# Altium project roneMotorBoard-v8-msp.PrjPcb
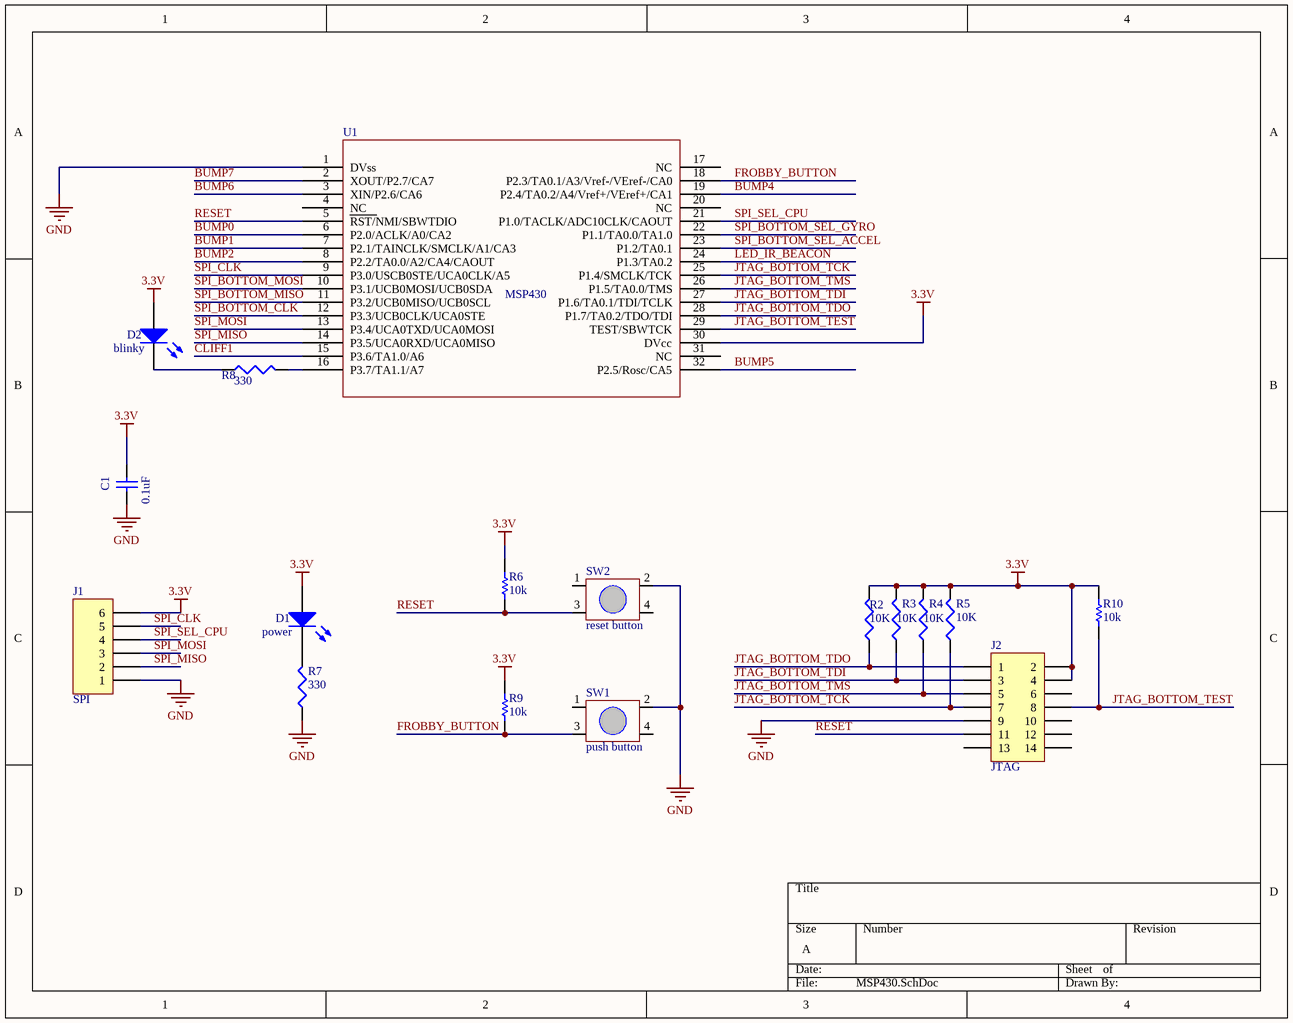
[diagram p0: MSP430.SchDoc]
5 sheets, 60 parts. Net scope: global (net labels, ports and power ports of the same name join across sheets).
Board file: roneMotorBoard-v8-msp.PcbDoc
Sheets:
  MSP430.SchDoc
  motorEncoder.SchDoc
  LineCliffSensors.SchDoc
  GyroAccelHeaders.SchDoc
  BumpSensors.SchDoc

## Sheet MSP430.SchDoc
size A

### Parts
C1  value 0.1uF  [CAPC1005L]  (hidden comment: Cap Semi)
D1  power  [INDC2012L]
D2  blinky  [INDC2012L]
J1  SPI  [HDR1X6]
J2  JTAG  [HDR2X7]
R2  value 10K  [RESC1608L]  (hidden comment: Res3)
R3  value 10K  [RESC1608L]  (hidden comment: Res3)
R4  value 10K  [RESC1608L]  (hidden comment: Res3)
R5  value 10K  [RESC1608L]  (hidden comment: Res3)
R6  value 10k  [RESC1608L]  (hidden comment: Res Semi)
R7  330  [RESC1608L]
R8  330  [RESC1608L]
R9  value 10k  [RESC1608L]  (hidden comment: Res Semi)
R10  value 10k  [RESC1608L]  (hidden comment: Res Semi)
SW1  push button  [SwitchTall-TL330]
SW2  reset button  [SwitchTall-TL330]
U1  MSP430  [MSP430_32PIN]

### Nets
3.3V: C1.2 D1.1(A) D2.1(A) J1.6 J2.2 J2.4 R2.2 R3.2 R4.2 R5.2 R6.2 R9.2 R10.2 U1.30(DVcc)
GND: C1.1 J1.1 J2.9 R7.1 SW1.2 SW2.2 U1.1(DVss)
BUMP0: U1.6(P2.0/ACLK/A0/CA2)
BUMP1: U1.7(P2.1/TAINCLK/SMCLK/A1/CA3)
BUMP2: U1.8(P2.2/TA0.0/A2/CA4/CAOUT)
BUMP4: U1.19(P2.4/TA0.2/A4/Vref+/VEref+/CA1)
BUMP5: U1.32(P2.5/Rosc/CA5)
BUMP6: U1.3(XIN/P2.6/CA6)
BUMP7: U1.2(XOUT/P2.7/CA7)
CLIFF1: U1.15(P3.6/TA1.0/A6)
FROBBY_BUTTON: R9.1 SW1.3 U1.18(P2.3/TA0.1/A3/Vref-/VEref-/CA0)
JTAG_BOTTOM_TCK: J2.7 R5.1 U1.25(P1.4/SMCLK/TCK)
JTAG_BOTTOM_TDI: J2.3 R3.1 U1.27(P1.6/TA0.1/TDI/TCLK)
JTAG_BOTTOM_TDO: J2.1 R2.1 U1.28(P1.7/TA0.2/TDO/TDI)
JTAG_BOTTOM_TEST: J2.8 R10.1 U1.29(TEST/SBWTCK)
JTAG_BOTTOM_TMS: J2.5 R4.1 U1.26(P1.5/TA0.0/TMS)
LED_IR_BEACON: U1.24(P1.3/TA0.2)
RESET: J2.11 R6.1 SW2.3 U1.5(RST/NMI/SBWTDIO)
SPI_BOTTOM_CLK: U1.12(P3.3/UCB0CLK/UCA0STE)
SPI_BOTTOM_MISO: U1.11(P3.2/UCB0MISO/UCB0SCL)
SPI_BOTTOM_MOSI: U1.10(P3.1/UCB0MOSI/UCB0SDA)
SPI_BOTTOM_SEL_ACCEL: U1.23(P1.2/TA0.1)
SPI_BOTTOM_SEL_GYRO: U1.22(P1.1/TA0.0/TA1.0)
SPI_CLK: J1.5 U1.9(P3.0/USCB0STE/UCA0CLK/A5)
SPI_MISO: J1.2 U1.14(P3.5/UCA0RXD/UCA0MISO)
SPI_MOSI: J1.3 U1.13(P3.4/UCA0TXD/UCA0MOSI)
SPI_SEL_CPU: J1.4 U1.21(P1.0/TACLK/ADC10CLK/CAOUT)
NetD1_2: D1.2(K) R7.2
NetD2_2: D2.2(K) R8.1
NetR8_2: R8.2 U1.16(P3.7/TA1.1/A7)

Not connected (* = marked no-connect by the designer): J2 6 10 12 13 14; SW1 1 4; SW2 1 4; U1 4(NC) 17(NC) 20(NC) 31(NC)

### Library data of the parts
C1 = Cap Semi: Capacitor (Semiconductor SIM Model); Published: 8-Jun-2000; LatestRevisionDate: 29-May-2009; LatestRevisionNote: IPC-7351 Footprint Added.; PackageReference: C1206; Publisher: Altium Limited; PackageDescription: Chip Capacitor
D1 D2 = LED
J1 = Header 6: Header, 6-Pin; LatestRevisionDate: 17-Jul-2002; LatestRevisionNote: Re-released for DXP Platform.; Publisher: Altium Limited
J2 = Header 7X2: Header, 7-Pin, Dual row; LatestRevisionDate: 17-Jul-2002; LatestRevisionNote: Re-released for DXP Platform.; Publisher: Altium Limited
R2-R5 = Res3: Resistor; Published: 8-Jun-2000; LatestRevisionDate: 29-May-2009; LatestRevisionNote: IPC-7351 Footprint Added.; PackageReference: J1-0603; Publisher: Altium Limited; PackageDescription: Chip Resistor
R6 R9 R10 = Res Semi: Semiconductor Resistor; Published: 8-Jun-2000; LatestRevisionDate: 17-Jul-2002; LatestRevisionNote: Re-released for DXP Platform.; PackageReference: AXIAL-0.5; Publisher: Altium Limited
R7 = Res3: Resistor; Value: res3; Published: 8-Jun-2000; LatestRevisionDate: 29-May-2009; LatestRevisionNote: IPC-7351 Footprint Added.; PackageReference: J1-0603; Publisher: Altium Limited; PackageDescription: Chip Resistor
R8 = Res3: Resistor; Value: RES3; Published: 8-Jun-2000; LatestRevisionDate: 29-May-2009; LatestRevisionNote: IPC-7351 Footprint Added.; PackageReference: J1-0603; Publisher: Altium Limited; PackageDescription: Chip Resistor
SW1 SW2 = Switch-TL330
U1 = MSP430_32pin

## Sheet motorEncoder.SchDoc
size A
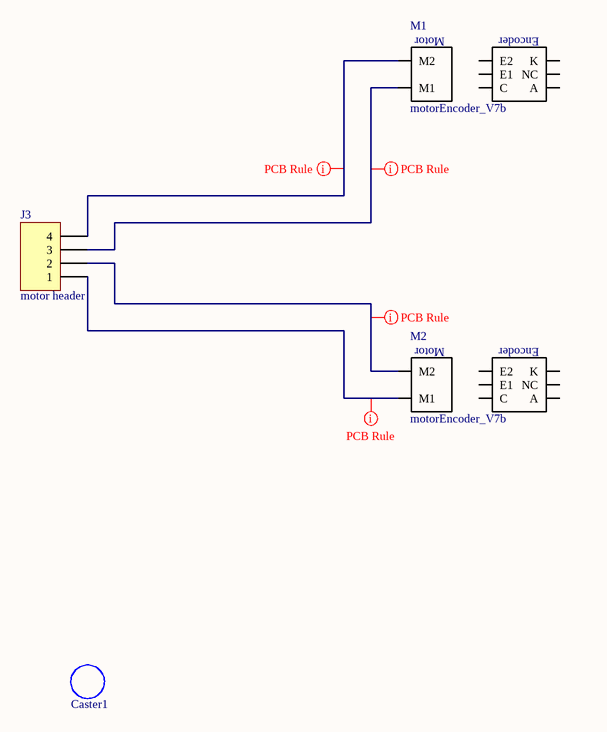
[diagram p1: motorEncoder.SchDoc]

### Parts
Caster1  non connect  [3/4"CASTER2]  (value not drawn)
J3  motor header  [HDR1X4]
M1  motorEncoder_V7b  [motorEncoder_V7b]
M2  motorEncoder_V7b  [motorEncoder_V7b]

### Nets
NetJ3_1: J3.1 M2.M1
NetJ3_2: J3.2 M2.M2
NetJ3_3: J3.3 M1.M1
NetJ3_4: J3.4 M1.M2

Not connected (* = marked no-connect by the designer): M1 A C E1 E2 K NC; M2 A C E1 E2 K NC

### Layout directives
rule Width Constraint [Pref Width = 20mil    Min Width = 10mil    Max Width = 25mil]: NetJ3_1, NetJ3_2, NetJ3_3, NetJ3_4

### Notes on the sheet
- (in symbol motorEncoder_V7b) Motor; Encoder

### Library data of the parts
Caster1 = Caster 3/4in: This is just a space saver to get the caster onto the pcb
J3 = Header 4: Header, 4-Pin; LatestRevisionDate: 17-Jul-2002; LatestRevisionNote: Re-released for DXP Platform.; Publisher: Altium Limited

## Sheet LineCliffSensors.SchDoc
size A
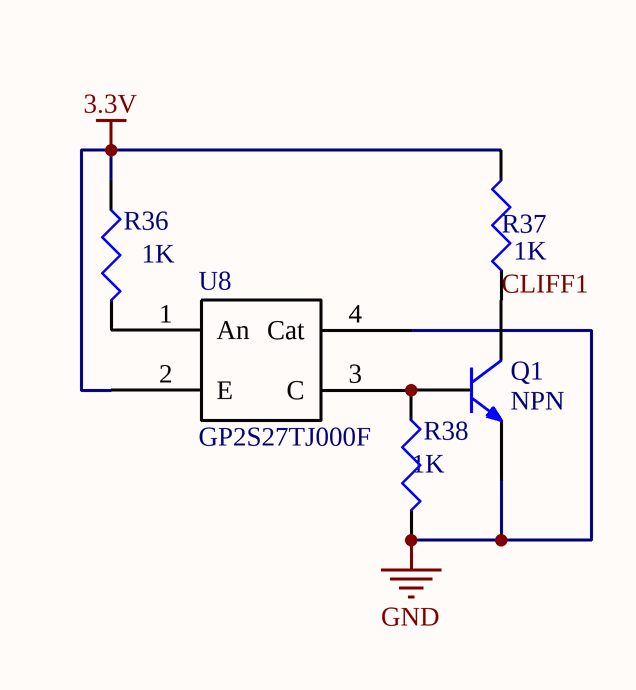
[diagram p2: LineCliffSensors.SchDoc]

### Parts
Q1  NPN  [SOT-23]
R36  value 1K  [RESC1608L]  (hidden comment: Res3)
R37  value 1K  [RESC1608L]  (hidden comment: Res3)
R38  value 1K  [RESC1608L]  (hidden comment: Res3)
U8  GP2S27TJ000F  [GP2S27J0000F]

### Nets
3.3V: R36.1 R37.2 U8.2(E)
GND: Q1.2(E) R38.2 U8.4(Cat)
CLIFF1: Q1.3(C) R37.1
NetQ1_1: Q1.1(B) R38.1 U8.3(C)
NetR36_2: R36.2 U8.1(An)

### Library data of the parts
R36-R38 = Res3: Resistor; Published: 8-Jun-2000; LatestRevisionDate: 29-May-2009; LatestRevisionNote: IPC-7351 Footprint Added.; PackageReference: J1-0603; Publisher: Altium Limited; PackageDescription: Chip Resistor

## Sheet GyroAccelHeaders.SchDoc
size A
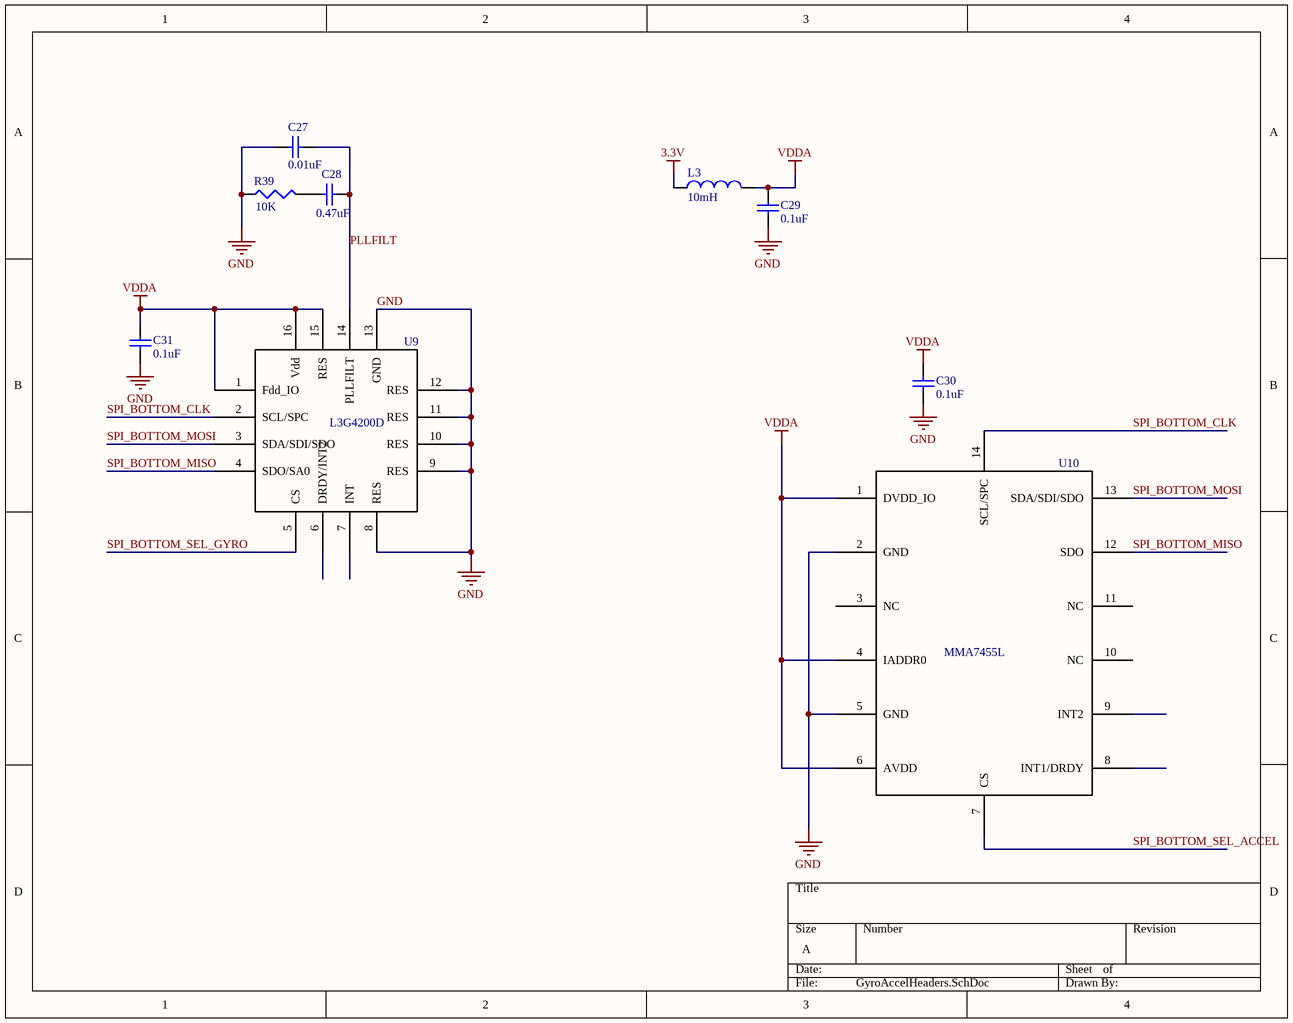
[diagram p3: GyroAccelHeaders.SchDoc]

### Parts
C27  value 0.01uF  [CAPC1005L]  (hidden comment: Cap Semi)
C28  value 0.47uF  [CAPC1005L]  (hidden comment: Cap Semi)
C29  value 0.1uF  [CAPC1005L]  (hidden comment: Cap Semi)
C30  value 0.1uF  [CAPC1005L]  (hidden comment: Cap Semi)
C31  value 0.1uF  [CAPC1005L]  (hidden comment: Cap Semi)
L3  value 10mH  [INDC2012L]  (hidden comment: Inductor)
R39  value 10K  [RESC1608L]  (hidden comment: Res3)
U9  L3G4200D  [L3G2004D]
U10  MMA7455L  [MMA7455L]

### Nets
3.3V: L3.2
GND: C27.2 C29.1 C30.1 C31.1 R39.1 U9.8(RES) U9.9(RES) U9.10(RES) U9.11(RES) U9.12(RES) U9.13(GND) U10.2(GND) U10.5(GND)
VDDA: C29.2 C30.2 C31.2 L3.1 U9.1(Fdd_IO) U9.15(RES) U9.16(Vdd) U10.1(DVDD_IO) U10.4(IADDR0) U10.6(AVDD)
PLLFILT: C27.1 C28.1 U9.14(PLLFILT)
SPI_BOTTOM_CLK: U9.2(SCL/SPC) U10.14(SCL/SPC)
SPI_BOTTOM_MISO: U9.4(SDO/SA0) U10.12(SDO)
SPI_BOTTOM_MOSI: U9.3(SDA/SDI/SDO) U10.13(SDA/SDI/SDO)
SPI_BOTTOM_SEL_ACCEL: U10.7(CS)
SPI_BOTTOM_SEL_GYRO: U9.5(CS)
NetC28_2: C28.2 R39.2

Not connected (* = marked no-connect by the designer): U9 6(DRDY/INT2) 7(INT); U10 3(NC) 8(INT1/DRDY) 9(INT2) 10(NC) 11(NC)

### Library data of the parts
C27-C31 = Cap Semi: Capacitor (Semiconductor SIM Model); Published: 8-Jun-2000; LatestRevisionDate: 29-May-2009; LatestRevisionNote: IPC-7351 Footprint Added.; PackageReference: C1206; Publisher: Altium Limited; PackageDescription: Chip Capacitor
L3 = Inductor: Code_IEC: 1005; Published: 8-Jun-2000; LatestRevisionDate: 29-May-2009; LatestRevisionNote: IPC-7351 Footprint Added.; PackageReference: 0402-A; Publisher: Altium Limited; PackageDescription: Chip Inductor; Code_JEITA: 0402
R39 = Res3: Resistor; Published: 8-Jun-2000; LatestRevisionDate: 29-May-2009; LatestRevisionNote: IPC-7351 Footprint Added.; PackageReference: J1-0603; Publisher: Altium Limited; PackageDescription: Chip Resistor
U9 = L3G4200D: 3axis gyroscope, SPI
U10 = MMA7455L: 3axis accelerometer

## Sheet BumpSensors.SchDoc
size A
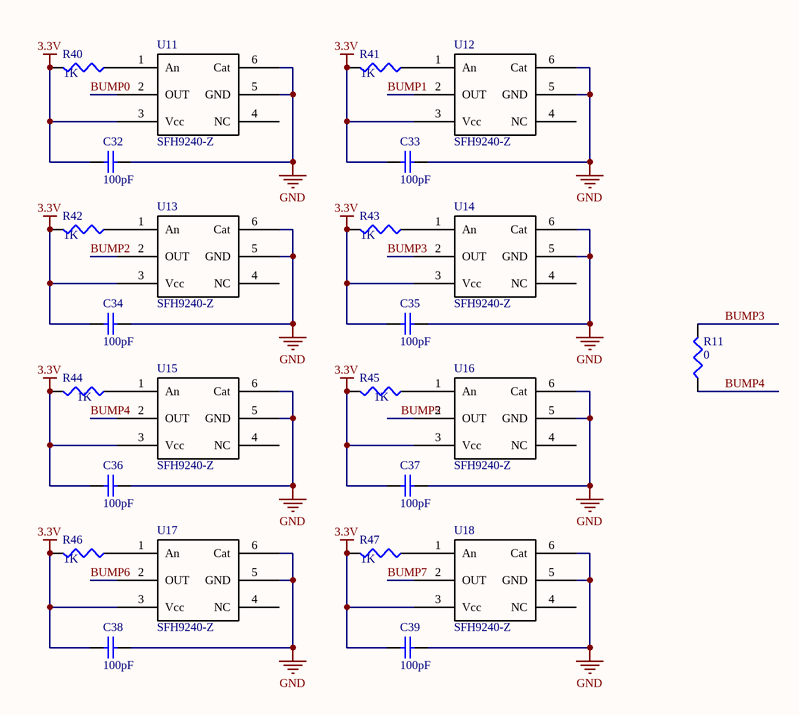
[diagram p4: BumpSensors.SchDoc]

### Parts
C32  value 100pF  [CAPC1005L]  (hidden comment: Cap Semi)
C33  value 100pF  [CAPC1005L]  (hidden comment: Cap Semi)
C34  value 100pF  [CAPC1005L]  (hidden comment: Cap Semi)
C35  value 100pF  [CAPC1005L]  (hidden comment: Cap Semi)
C36  value 100pF  [CAPC1005L]  (hidden comment: Cap Semi)
C37  value 100pF  [CAPC1005L]  (hidden comment: Cap Semi)
C38  value 100pF  [CAPC1005L]  (hidden comment: Cap Semi)
C39  value 100pF  [CAPC1005L]  (hidden comment: Cap Semi)
R11  value 0  [RESC1608L]  (hidden comment: Res3)
R40  value 1K  [RESC1608L]  (hidden comment: Res3)
R41  value 1K  [RESC1608L]  (hidden comment: Res3)
R42  value 1K  [RESC1608L]  (hidden comment: Res3)
R43  value 1K  [RESC1608L]  (hidden comment: Res3)
R44  value 1K  [RESC1608L]  (hidden comment: Res3)
R45  value 1K  [RESC1608L]  (hidden comment: Res3)
R46  value 1K  [RESC1608L]  (hidden comment: Res3)
R47  value 1K  [RESC1608L]  (hidden comment: Res3)
U11  SFH9240-Z  [SFH9240-Z]
U12  SFH9240-Z  [SFH9240-Z]
U13  SFH9240-Z  [SFH9240-Z]
U14  SFH9240-Z  [SFH9240-Z]
U15  SFH9240-Z  [SFH9240-Z]
U16  SFH9240-Z  [SFH9240-Z]
U17  SFH9240-Z  [SFH9240-Z]
U18  SFH9240-Z  [SFH9240-Z]

### Nets
3.3V: C32.2 C33.2 C34.2 C35.2 C36.2 C37.2 C38.2 C39.2 R40.2 R41.2 R42.2 R43.2 R44.2 R45.2 R46.2 R47.2 U11.3(Vcc) U12.3(Vcc) U13.3(Vcc) U14.3(Vcc) U15.3(Vcc) U16.3(Vcc) U17.3(Vcc) U18.3(Vcc)
GND: C32.1 C33.1 C34.1 C35.1 C36.1 C37.1 C38.1 C39.1 U11.5(GND) U11.6(Cat) U12.5(GND) U12.6(Cat) U13.5(GND) U13.6(Cat) U14.5(GND) U14.6(Cat) U15.5(GND) U15.6(Cat) U16.5(GND) U16.6(Cat) U17.5(GND) U17.6(Cat) U18.5(GND) U18.6(Cat)
BUMP0: U11.2(OUT)
BUMP1: U12.2(OUT)
BUMP2: U13.2(OUT)
BUMP3: R11.2 U14.2(OUT)
BUMP4: R11.1 U15.2(OUT)
BUMP5: U16.2(OUT)
BUMP6: U17.2(OUT)
BUMP7: U18.2(OUT)
NetR40_1: R40.1 U11.1(An)
NetR41_1: R41.1 U12.1(An)
NetR42_1: R42.1 U13.1(An)
NetR43_1: R43.1 U14.1(An)
NetR44_1: R44.1 U15.1(An)
NetR45_1: R45.1 U16.1(An)
NetR46_1: R46.1 U17.1(An)
NetR47_1: R47.1 U18.1(An)

Not connected (* = marked no-connect by the designer): U11 4(NC); U12 4(NC); U13 4(NC); U14 4(NC); U15 4(NC); U16 4(NC); U17 4(NC); U18 4(NC)

### Library data of the parts
C32-C39 = Cap Semi: Capacitor (Semiconductor SIM Model); Published: 8-Jun-2000; LatestRevisionDate: 29-May-2009; LatestRevisionNote: IPC-7351 Footprint Added.; PackageReference: C1206; Publisher: Altium Limited; PackageDescription: Chip Capacitor
R11 R40-R47 = Res3: Resistor; Published: 8-Jun-2000; LatestRevisionDate: 29-May-2009; LatestRevisionNote: IPC-7351 Footprint Added.; PackageReference: J1-0603; Publisher: Altium Limited; PackageDescription: Chip Resistor

## Nets that join several sheets
3.3V: MSP430 (14 pins), LineCliffSensors (R36.1 R37.2 U8.2), GyroAccelHeaders (L3.2), BumpSensors (24 pins)
GND: MSP430 (7 pins), LineCliffSensors (Q1.2 R38.2 U8.4), GyroAccelHeaders (13 pins), BumpSensors (24 pins)
BUMP0: MSP430 (U1.6), BumpSensors (U11.2)
BUMP1: MSP430 (U1.7), BumpSensors (U12.2)
BUMP2: MSP430 (U1.8), BumpSensors (U13.2)
BUMP4: MSP430 (U1.19), BumpSensors (R11.1 U15.2)
BUMP5: MSP430 (U1.32), BumpSensors (U16.2)
BUMP6: MSP430 (U1.3), BumpSensors (U17.2)
BUMP7: MSP430 (U1.2), BumpSensors (U18.2)
CLIFF1: MSP430 (U1.15), LineCliffSensors (Q1.3 R37.1)
SPI_BOTTOM_CLK: MSP430 (U1.12), GyroAccelHeaders (U9.2 U10.14)
SPI_BOTTOM_MISO: MSP430 (U1.11), GyroAccelHeaders (U9.4 U10.12)
SPI_BOTTOM_MOSI: MSP430 (U1.10), GyroAccelHeaders (U9.3 U10.13)
SPI_BOTTOM_SEL_ACCEL: MSP430 (U1.23), GyroAccelHeaders (U10.7)
SPI_BOTTOM_SEL_GYRO: MSP430 (U1.22), GyroAccelHeaders (U9.5)